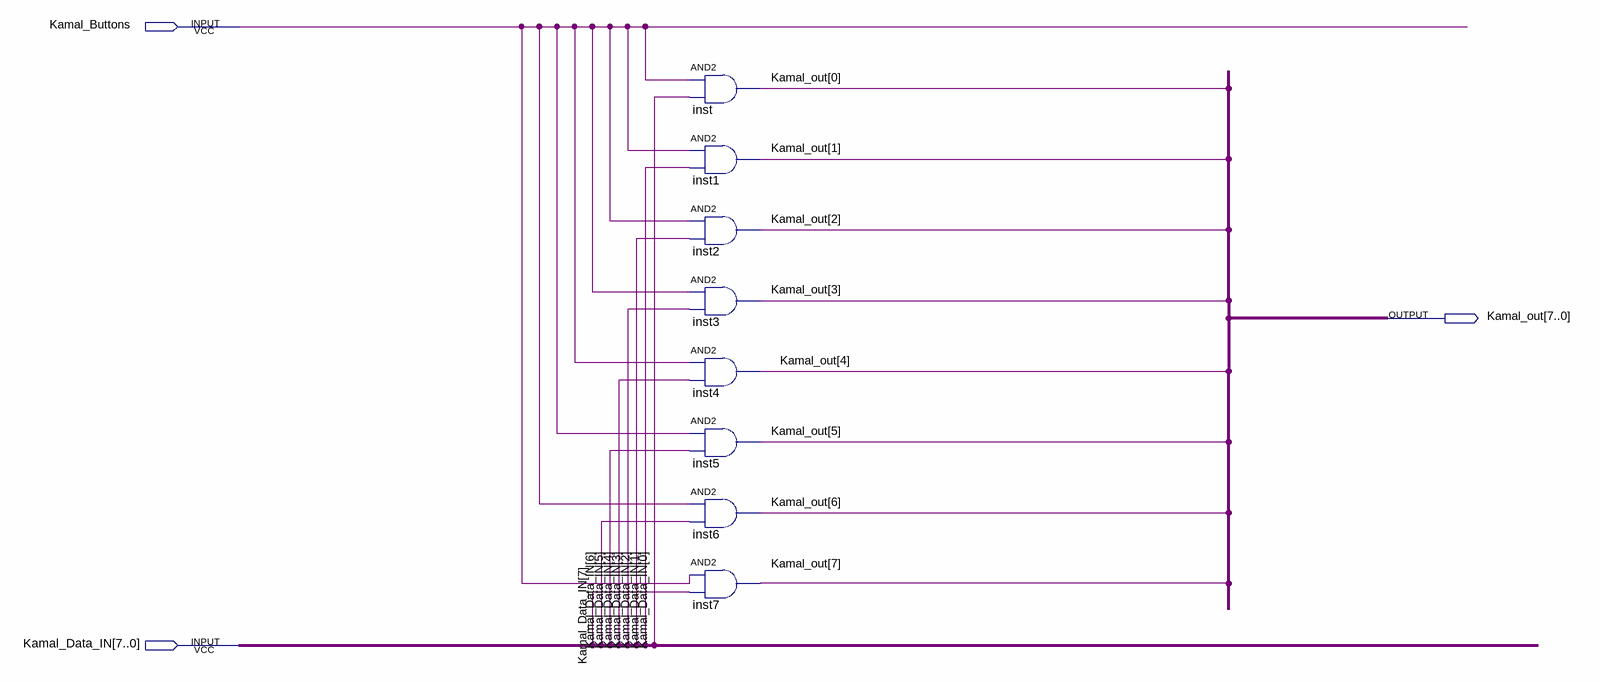
[diagram p0: schematic sheet]
// Quartus schematic Kamal_Button.bdf as structural Verilog: 8 symbols, 3 pins
module Kamal_Button (
  input  Kamal_Buttons,
  input  [7:0] Kamal_Data_IN,
  output [7:0] Kamal_out
);

  and inst (Kamal_out[0], Kamal_Buttons, Kamal_Data_IN[0]);
  and inst1 (Kamal_out[1], Kamal_Buttons, Kamal_Data_IN[1]);
  and inst2 (Kamal_out[2], Kamal_Buttons, Kamal_Data_IN[2]);
  and inst3 (Kamal_out[3], Kamal_Buttons, Kamal_Data_IN[3]);
  and inst4 (Kamal_out[4], Kamal_Buttons, Kamal_Data_IN[4]);
  and inst5 (Kamal_out[5], Kamal_Buttons, Kamal_Data_IN[5]);
  and inst6 (Kamal_out[6], Kamal_Buttons, Kamal_Data_IN[6]);
  and inst7 (Kamal_out[7], Kamal_Buttons, Kamal_Data_IN[7]);
endmodule
